# Altium schematic sheet MPCBoard.SchDoc
size 558 x 508 mm; SheetNumber: 1; SheetTotal: 1
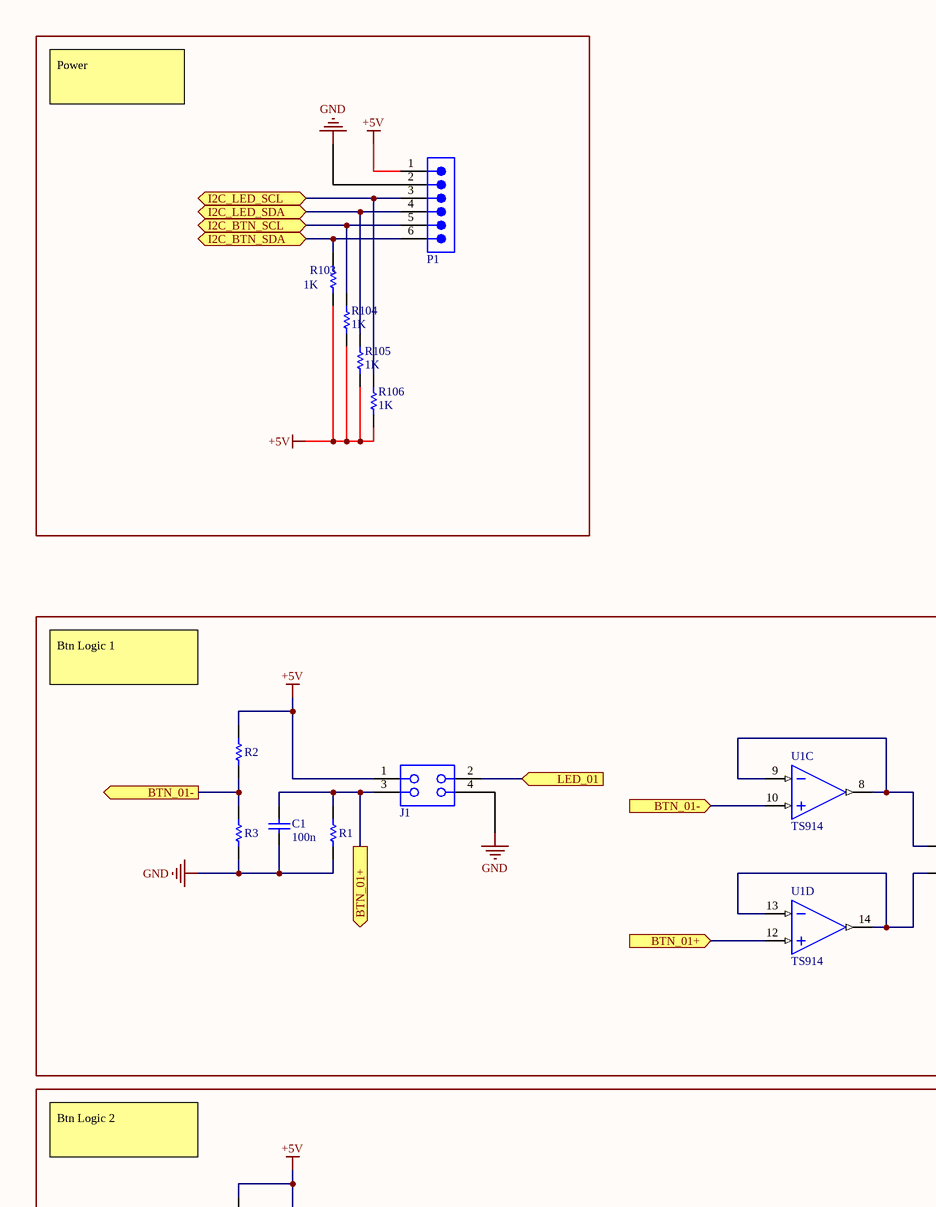
[diagram p0: MPCBoard.SchDoc, top left]
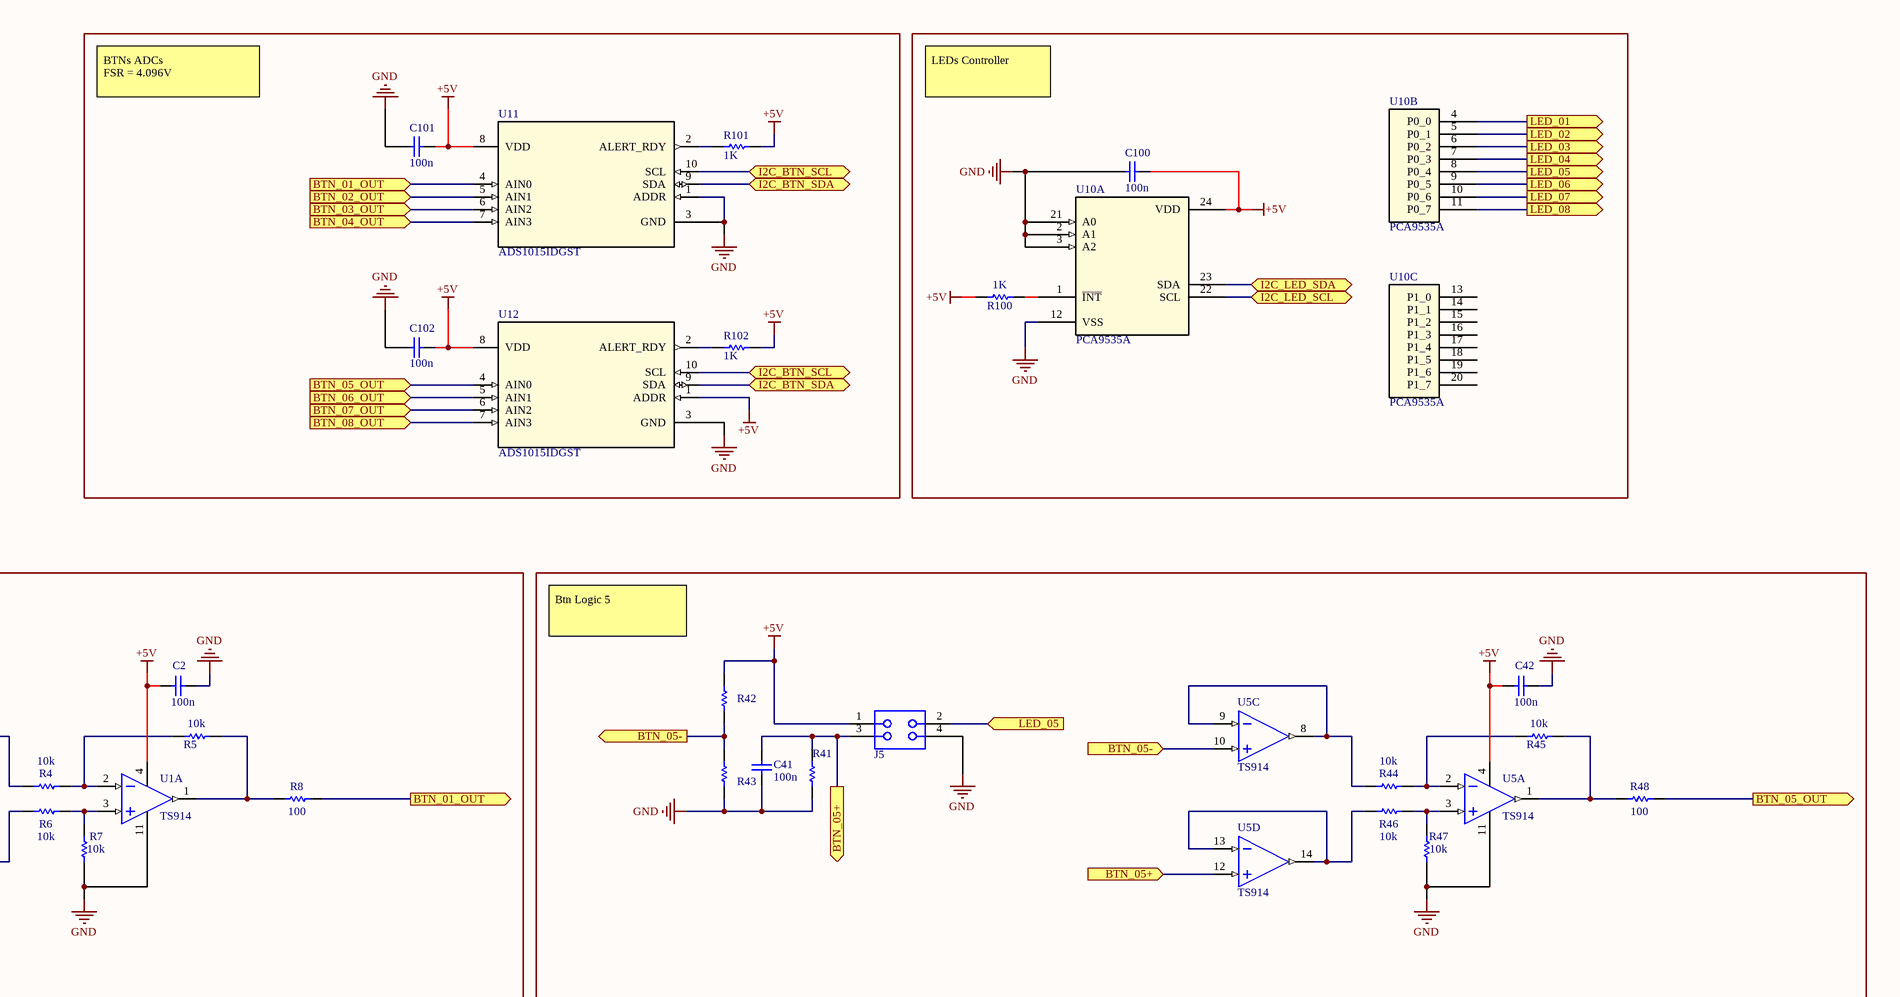
[diagram p1: MPCBoard.SchDoc, top right]
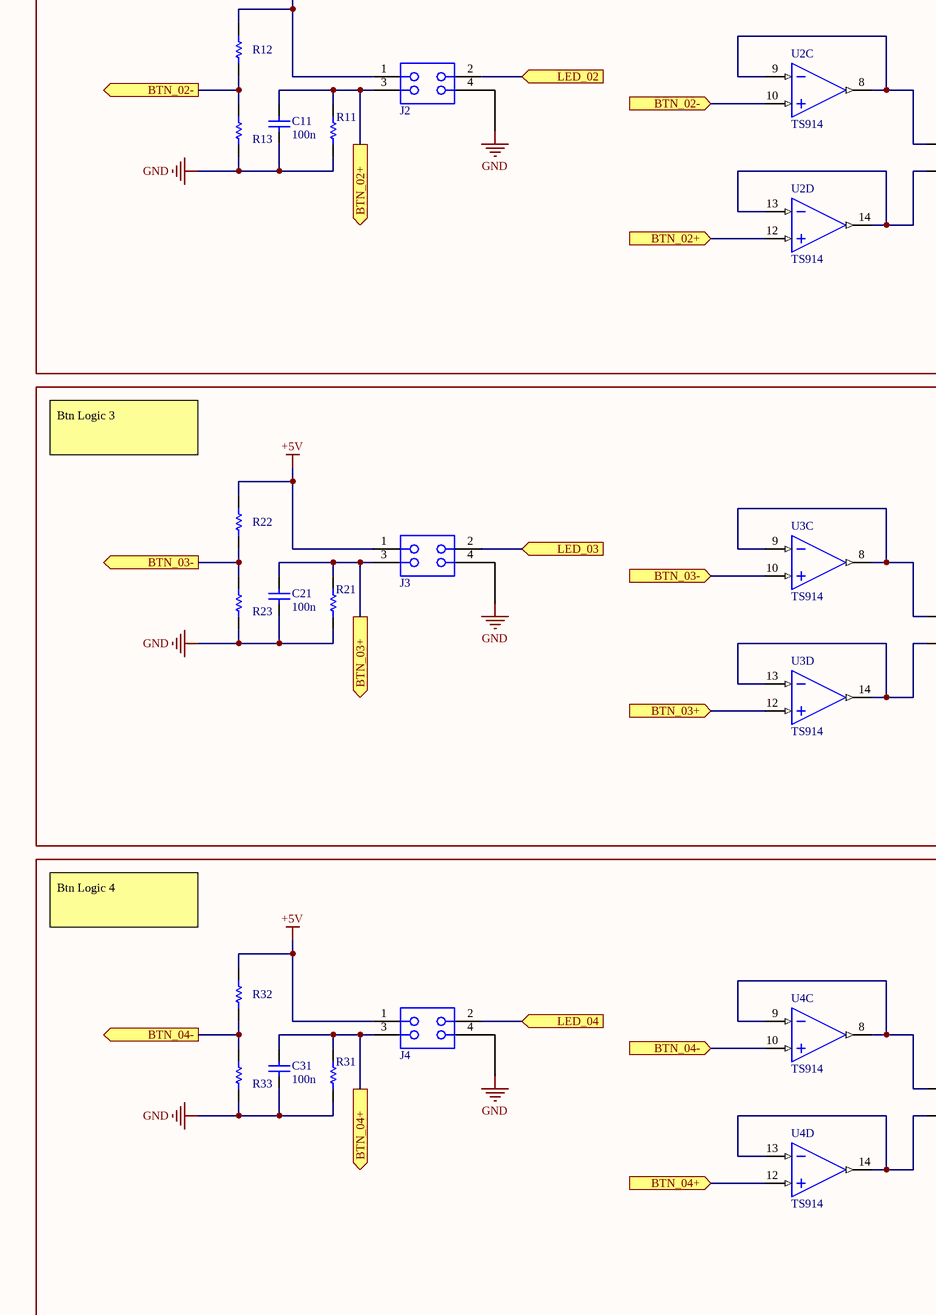
[diagram p2: MPCBoard.SchDoc, bottom left]
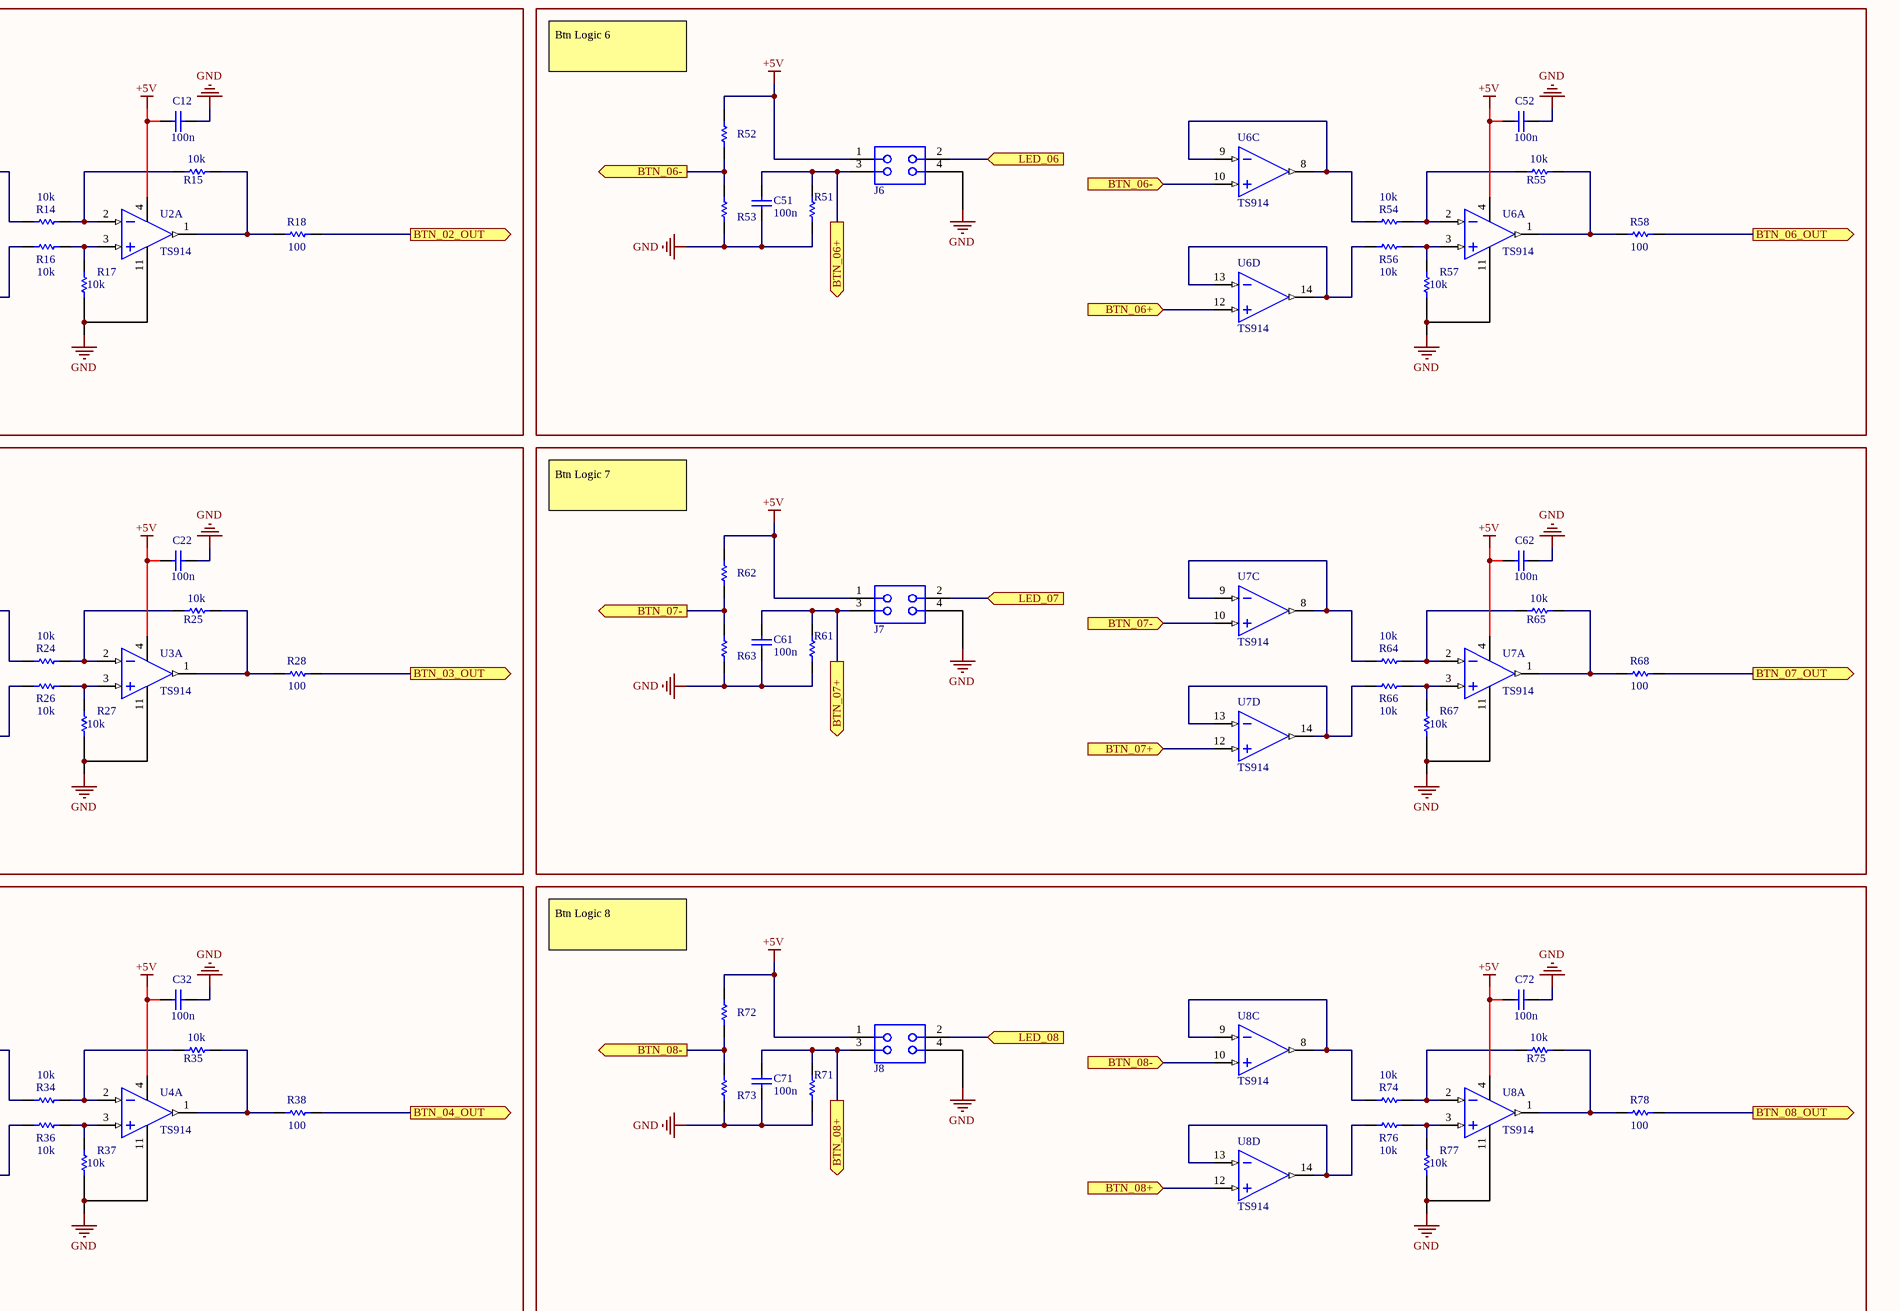
[diagram p3: MPCBoard.SchDoc, bottom right]

## Parts
C1  100n  [CAPC0603(1608)100_N]
C2  100n  [CAPC0603(1608)100_N]
C11  100n  [CAPC0603(1608)100_N]
C12  100n  [CAPC0603(1608)100_N]
C21  100n  [CAPC0603(1608)100_N]
C22  100n  [CAPC0603(1608)100_N]
C31  100n  [CAPC0603(1608)100_N]
C32  100n  [CAPC0603(1608)100_N]
C41  100n  [CAPC0603(1608)100_N]
C42  100n  [CAPC0603(1608)100_N]
C51  100n  [CAPC0603(1608)100_N]
C52  100n  [CAPC0603(1608)100_N]
C61  100n  [CAPC0603(1608)100_N]
C62  100n  [CAPC0603(1608)100_N]
C71  100n  [CAPC0603(1608)100_N]
C72  100n  [CAPC0603(1608)100_N]
C100  100n  [CAPC0603(1608)100_N]
C101  100n  [CAPC0603(1608)100_N]
C102  100n  [CAPC0603(1608)100_N]
J1  62000421821  [62000421821]  (value not drawn)
J2  62000421821  [62000421821]  (value not drawn)
J3  62000421821  [62000421821]  (value not drawn)
J4  62000421821  [62000421821]  (value not drawn)
J5  62000421821  [62000421821]  (value not drawn)
J6  62000421821  [62000421821]  (value not drawn)
J7  62000421821  [62000421821]  (value not drawn)
J8  62000421821  [62000421821]  (value not drawn)
P1  61300611121  [61300611121]  (value not drawn)
R1  RES  [RESC0603(1608)_N]  (value not drawn)
R2  RES  [RESC0603(1608)_N]  (value not drawn)
R3  RES  [RESC0603(1608)_N]  (value not drawn)
R4  10k  [RESC0603(1608)_N]
R5  10k  [RESC0603(1608)_N]
R6  10k  [RESC0603(1608)_N]
R7  10k  [RESC0603(1608)_N]
R8  100  [RESC0603(1608)_N]
R11  RES  [RESC0603(1608)_N]  (value not drawn)
R12  RES  [RESC0603(1608)_N]  (value not drawn)
R13  RES  [RESC0603(1608)_N]  (value not drawn)
R14  10k  [RESC0603(1608)_N]
R15  10k  [RESC0603(1608)_N]
R16  10k  [RESC0603(1608)_N]
R17  10k  [RESC0603(1608)_N]
R18  100  [RESC0603(1608)_N]
R21  RES  [RESC0603(1608)_N]  (value not drawn)
R22  RES  [RESC0603(1608)_N]  (value not drawn)
R23  RES  [RESC0603(1608)_N]  (value not drawn)
R24  10k  [RESC0603(1608)_N]
R25  10k  [RESC0603(1608)_N]
R26  10k  [RESC0603(1608)_N]
R27  10k  [RESC0603(1608)_N]
R28  100  [RESC0603(1608)_N]
R31  RES  [RESC0603(1608)_N]  (value not drawn)
R32  RES  [RESC0603(1608)_N]  (value not drawn)
R33  RES  [RESC0603(1608)_N]  (value not drawn)
R34  10k  [RESC0603(1608)_N]
R35  10k  [RESC0603(1608)_N]
R36  10k  [RESC0603(1608)_N]
R37  10k  [RESC0603(1608)_N]
R38  100  [RESC0603(1608)_N]
R41  RES  [RESC0603(1608)_N]  (value not drawn)
R42  RES  [RESC0603(1608)_N]  (value not drawn)
R43  RES  [RESC0603(1608)_N]  (value not drawn)
R44  10k  [RESC0603(1608)_N]
R45  10k  [RESC0603(1608)_N]
R46  10k  [RESC0603(1608)_N]
R47  10k  [RESC0603(1608)_N]
R48  100  [RESC0603(1608)_N]
R51  RES  [RESC0603(1608)_N]  (value not drawn)
R52  RES  [RESC0603(1608)_N]  (value not drawn)
R53  RES  [RESC0603(1608)_N]  (value not drawn)
R54  10k  [RESC0603(1608)_N]
R55  10k  [RESC0603(1608)_N]
R56  10k  [RESC0603(1608)_N]
R57  10k  [RESC0603(1608)_N]
R58  100  [RESC0603(1608)_N]
R61  RES  [RESC0603(1608)_N]  (value not drawn)
R62  RES  [RESC0603(1608)_N]  (value not drawn)
R63  RES  [RESC0603(1608)_N]  (value not drawn)
R64  10k  [RESC0603(1608)_N]
R65  10k  [RESC0603(1608)_N]
R66  10k  [RESC0603(1608)_N]
R67  10k  [RESC0603(1608)_N]
R68  100  [RESC0603(1608)_N]
R71  RES  [RESC0603(1608)_N]  (value not drawn)
R72  RES  [RESC0603(1608)_N]  (value not drawn)
R73  RES  [RESC0603(1608)_N]  (value not drawn)
R74  10k  [RESC0603(1608)_N]
R75  10k  [RESC0603(1608)_N]
R76  10k  [RESC0603(1608)_N]
R77  10k  [RESC0603(1608)_N]
R78  100  [RESC0603(1608)_N]
R100  1K  [RESC0603(1608)_N]
R101  1K  [RESC0603(1608)_N]
R102  1K  [RESC0603(1608)_N]
R103  1K  [RESC0603(1608)_N]
R104  1K  [RESC0603(1608)_N]
R105  1K  [RESC0603(1608)_N]
R106  1K  [RESC0603(1608)_N]
U1  TS914  [SO-14_STM]  (parts A,C,D of 4)
U2  TS914  [SO-14_STM]  (parts A,C,D of 4)
U3  TS914  [SO-14_STM]  (parts A,C,D of 4)
U4  TS914  [SO-14_STM]  (parts A,C,D of 4)
U5  TS914  [SO-14_STM]  (parts A,C,D of 4)
U6  TS914  [SO-14_STM]  (parts A,C,D of 4)
U7  TS914  [SO-14_STM]  (parts A,C,D of 4)
U8  TS914  [SO-14_STM]  (parts A,C,D of 4)
U10  PCA9535A  [TSSOP24-8N]  (parts A,B,C of 3)
U11  ADS1015IDGST  [DGS0010A_N]
U12  ADS1015IDGST  [DGS0010A_N]

## Ports
BTN_01+ (in, see MPCBoard[1B]), BTN_01+ (out, see MPCBoard[2B]), BTN_01- (in, see MPCBoard[1B]), BTN_01- (out, see MPCBoard[2B]), BTN_01_OUT (in, see MPCBoard[3B]), BTN_01_OUT (out, see MPCBoard[3A]), BTN_02+ (in, see MPCBoard[1C]), BTN_02+ (out, see MPCBoard[2C]), BTN_02- (in, see MPCBoard[1B]), BTN_02- (out, see MPCBoard[2B]), BTN_02_OUT (in, see MPCBoard[3B]), BTN_02_OUT (out, see MPCBoard[3A]), BTN_03+ (in, see MPCBoard[1C]), BTN_03+ (out, see MPCBoard[2C]), BTN_03- (in, see MPCBoard[1C]), BTN_03- (out, see MPCBoard[2C]), BTN_03_OUT (in, see MPCBoard[3C]), BTN_03_OUT (out, see MPCBoard[3A]), BTN_04+ (in, see MPCBoard[1D]), BTN_04+ (out, see MPCBoard[2D]), BTN_04- (in, see MPCBoard[1D]), BTN_04- (out, see MPCBoard[2D]), BTN_04_OUT (in, see MPCBoard[3D]), BTN_04_OUT (out, see MPCBoard[3A]), BTN_05+ (in, see MPCBoard[4B]), BTN_05+ (out, see MPCBoard[5B]), BTN_05- (in, see MPCBoard[4B]), BTN_05- (out, see MPCBoard[5B]), BTN_05_OUT (in, see MPCBoard[6B]), BTN_05_OUT (out, see MPCBoard[3A]), BTN_06+ (in, see MPCBoard[4C]), BTN_06+ (out, see MPCBoard[5C]), BTN_06- (in, see MPCBoard[4B]), BTN_06- (out, see MPCBoard[5B]), BTN_06_OUT (in, see MPCBoard[6B]), BTN_06_OUT (out, see MPCBoard[3A]), BTN_07+ (in, see MPCBoard[4C]), BTN_07+ (out, see MPCBoard[5C]), BTN_07- (in, see MPCBoard[4C]), BTN_07- (out, see MPCBoard[5C]), BTN_07_OUT (in, see MPCBoard[6C]), BTN_07_OUT (out, see MPCBoard[3A]), BTN_08+ (in, see MPCBoard[4D]), BTN_08+ (out, see MPCBoard[5D]), BTN_08- (in, see MPCBoard[4D]), BTN_08- (out, see MPCBoard[5D]), BTN_08_OUT (in, see MPCBoard[6D]), BTN_08_OUT (out, see MPCBoard[3A]), I2C_BTN_SCL (bidir, see MPCBoard[1A], MPCBoard[4A]), I2C_BTN_SCL (bidir, see MPCBoard[4A]), I2C_BTN_SDA (bidir, see MPCBoard[1A], MPCBoard[4A]), I2C_BTN_SDA (bidir, see MPCBoard[4A]), I2C_LED_SCL (bidir, see MPCBoard[1A]), I2C_LED_SCL (bidir, see MPCBoard[5A]), I2C_LED_SDA (bidir, see MPCBoard[1A]), I2C_LED_SDA (bidir, see MPCBoard[5A]), LED_01 (in, see MPCBoard[6A]), LED_01 (out, see MPCBoard[2B]), LED_02 (in, see MPCBoard[6A]), LED_02 (out, see MPCBoard[2B]), LED_03 (in, see MPCBoard[6A]), LED_03 (out, see MPCBoard[2C]), LED_04 (in, see MPCBoard[6A]), LED_04 (out, see MPCBoard[2D]), LED_05 (in, see MPCBoard[6A]), LED_05 (out, see MPCBoard[4B]), LED_06 (in, see MPCBoard[6A]), LED_06 (out, see MPCBoard[4B]), LED_07 (in, see MPCBoard[6A]), LED_07 (out, see MPCBoard[4C]), LED_08 (in, see MPCBoard[6A]), LED_08 (out, see MPCBoard[4D])

## Nets
+5V: C2.1 C12.1 C22.1 C32.1 C42.1 C52.1 C62.1 C72.1 C100.2 C101.2 C102.2 J1.1 J2.1 J3.1 J4.1 J5.1 J6.1 J7.1 J8.1 P1.1 R2.1 R12.1 R22.1 R32.1 R42.1 R52.1 R62.1 R72.1 R100.1 R101.1 R102.1 R103.2 R104.2 R105.2 R106.2 U1.4(Vcc+) U2.4(Vcc+) U3.4(Vcc+) U4.4(Vcc+) U5.4(Vcc+) U6.4(Vcc+) U7.4(Vcc+) U8.4(Vcc+) U10.24(VDD) U11.8(VDD) U12.1(ADDR) U12.8(VDD)
GND: C1.1 C2.2 C11.1 C12.2 C21.1 C22.2 C31.1 C32.2 C41.1 C42.2 C51.1 C52.2 C61.1 C62.2 C71.1 C72.2 C100.1 C101.1 C102.1 J1.4 J2.4 J3.4 J4.4 J5.4 J6.4 J7.4 J8.4 P1.2 R1.2 R3.2 R7.1 R11.2 R13.2 R17.1 R21.2 R23.2 R27.1 R31.2 R33.2 R37.1 R41.2 R43.2 R47.1 R51.2 R53.2 R57.1 R61.2 R63.2 R67.1 R71.2 R73.2 R77.1 U1.11(Vcc-) U2.11(Vcc-) U3.11(Vcc-) U4.11(Vcc-) U5.11(Vcc-) U6.11(Vcc-) U7.11(Vcc-) U8.11(Vcc-) U10.2(A1) U10.3(A2) U10.12(VSS) U10.21(A0) U11.1(ADDR) U11.3(GND) U12.3(GND)
BTN_01+: C1.2 J1.3 R1.1 U1.12(Non-Inverting) ; port BTN_01+
BTN_01-: R2.2 R3.1 U1.10(Non-Inverting) ; port BTN_01-
BTN_01_OUT: R8.1 U11.4(AIN0) ; port BTN_01_OUT
BTN_02+: C11.2 J2.3 R11.1 U2.12(Non-Inverting) ; port BTN_02+
BTN_02-: R12.2 R13.1 U2.10(Non-Inverting) ; port BTN_02-
BTN_02_OUT: R18.1 U11.5(AIN1) ; port BTN_02_OUT
BTN_03+: C21.2 J3.3 R21.1 U3.12(Non-Inverting) ; port BTN_03+
BTN_03-: R22.2 R23.1 U3.10(Non-Inverting) ; port BTN_03-
BTN_03_OUT: R28.1 U11.6(AIN2) ; port BTN_03_OUT
BTN_04+: C31.2 J4.3 R31.1 U4.12(Non-Inverting) ; port BTN_04+
BTN_04-: R32.2 R33.1 U4.10(Non-Inverting) ; port BTN_04-
BTN_04_OUT: R38.1 U11.7(AIN3) ; port BTN_04_OUT
BTN_05+: C41.2 J5.3 R41.1 U5.12(Non-Inverting) ; port BTN_05+
BTN_05-: R42.2 R43.1 U5.10(Non-Inverting) ; port BTN_05-
BTN_05_OUT: R48.1 U12.4(AIN0) ; port BTN_05_OUT
BTN_06+: C51.2 J6.3 R51.1 U6.12(Non-Inverting) ; port BTN_06+
BTN_06-: R52.2 R53.1 U6.10(Non-Inverting) ; port BTN_06-
BTN_06_OUT: R58.1 U12.5(AIN1) ; port BTN_06_OUT
BTN_07+: C61.2 J7.3 R61.1 U7.12(Non-Inverting) ; port BTN_07+
BTN_07-: R62.2 R63.1 U7.10(Non-Inverting) ; port BTN_07-
BTN_07_OUT: R68.1 U12.6(AIN2) ; port BTN_07_OUT
BTN_08+: C71.2 J8.3 R71.1 U8.12(Non-Inverting) ; port BTN_08+
BTN_08-: R72.2 R73.1 U8.10(Non-Inverting) ; port BTN_08-
BTN_08_OUT: R78.1 U12.7(AIN3) ; port BTN_08_OUT
I2C_BTN_SCL: P1.5 R104.1 U11.10(SCL) U12.10(SCL) ; port I2C_BTN_SCL
I2C_BTN_SDA: P1.6 R103.1 U11.9(SDA) U12.9(SDA) ; port I2C_BTN_SDA
I2C_LED_SCL: P1.3 R106.1 U10.22(SCL) ; port I2C_LED_SCL
I2C_LED_SDA: P1.4 R105.1 U10.23(SDA) ; port I2C_LED_SDA
LED_01: J1.2 U10.4(P0_0) ; port LED_01
LED_02: J2.2 U10.5(P0_1) ; port LED_02
LED_03: J3.2 U10.6(P0_2) ; port LED_03
LED_04: J4.2 U10.7(P0_3) ; port LED_04
LED_05: J5.2 U10.8(P0_4) ; port LED_05
LED_06: J6.2 U10.9(P0_5) ; port LED_06
LED_07: J7.2 U10.10(P0_6) ; port LED_07
LED_08: J8.2 U10.11(P0_7) ; port LED_08
NetR4_1: R4.1 U1.8(Output) U1.9(Inverting)
NetR4_2: R4.2 R5.2 U1.2(Inverting)
NetR5_1: R5.1 R8.2 U1.1(Output)
NetR6_1: R6.1 U1.13(Inverting) U1.14(Output)
NetR6_2: R6.2 R7.2 U1.3(Non-Inverting)
NetR14_1: R14.1 U2.8(Output) U2.9(Inverting)
NetR14_2: R14.2 R15.2 U2.2(Inverting)
NetR15_1: R15.1 R18.2 U2.1(Output)
NetR16_1: R16.1 U2.13(Inverting) U2.14(Output)
NetR16_2: R16.2 R17.2 U2.3(Non-Inverting)
NetR24_1: R24.1 U3.8(Output) U3.9(Inverting)
NetR24_2: R24.2 R25.2 U3.2(Inverting)
NetR25_1: R25.1 R28.2 U3.1(Output)
NetR26_1: R26.1 U3.13(Inverting) U3.14(Output)
NetR26_2: R26.2 R27.2 U3.3(Non-Inverting)
NetR34_1: R34.1 U4.8(Output) U4.9(Inverting)
NetR34_2: R34.2 R35.2 U4.2(Inverting)
NetR35_1: R35.1 R38.2 U4.1(Output)
NetR36_1: R36.1 U4.13(Inverting) U4.14(Output)
NetR36_2: R36.2 R37.2 U4.3(Non-Inverting)
NetR44_1: R44.1 U5.8(Output) U5.9(Inverting)
NetR44_2: R44.2 R45.2 U5.2(Inverting)
NetR45_1: R45.1 R48.2 U5.1(Output)
NetR46_1: R46.1 U5.13(Inverting) U5.14(Output)
NetR46_2: R46.2 R47.2 U5.3(Non-Inverting)
NetR54_1: R54.1 U6.8(Output) U6.9(Inverting)
NetR54_2: R54.2 R55.2 U6.2(Inverting)
NetR55_1: R55.1 R58.2 U6.1(Output)
NetR56_1: R56.1 U6.13(Inverting) U6.14(Output)
NetR56_2: R56.2 R57.2 U6.3(Non-Inverting)
NetR64_1: R64.1 U7.8(Output) U7.9(Inverting)
NetR64_2: R64.2 R65.2 U7.2(Inverting)
NetR65_1: R65.1 R68.2 U7.1(Output)
NetR66_1: R66.1 U7.13(Inverting) U7.14(Output)
NetR66_2: R66.2 R67.2 U7.3(Non-Inverting)
NetR74_1: R74.1 U8.8(Output) U8.9(Inverting)
NetR74_2: R74.2 R75.2 U8.2(Inverting)
NetR75_1: R75.1 R78.2 U8.1(Output)
NetR76_1: R76.1 U8.13(Inverting) U8.14(Output)
NetR76_2: R76.2 R77.2 U8.3(Non-Inverting)
NetR100_2: R100.2 U10.1(~{INT})
NetR101_2: R101.2 U11.2(ALERT_RDY)
NetR102_2: R102.2 U12.2(ALERT_RDY)

Not connected (* = marked no-connect by the designer): U10 13(P1_0) 14(P1_1) 15(P1_2) 16(P1_3) 17(P1_4) 18(P1_5) 19(P1_6) 20(P1_7)

## Notes on the sheet
- Power
- BTNs ADCs
  FSR = 4.096V
- LEDs Controller
- Btn Logic 1
- Btn Logic 5
- Btn Logic 2
- Btn Logic 6
- Btn Logic 3
- Btn Logic 7
- Btn Logic 4
- Btn Logic 8

## Library data of the parts
C1 C2 C11 C12 C21 C22 C31 C32 C41 C42 C51 C52 C61 C62 C71 C72 C100-C102 = CAP
J1-J8 = 62000421821: WR-PHD Socket Header, THT, Vertical, pitch 2mm, 2 Row, 4P; Manufacturer: Wurth Elektronik; Contact Resistance: 20mOhm; Rated Current: 2A; Working Voltage: 250V; Withstanding Voltage: 500V; System: Connector; Manufacturer Part Number: 62000421821; Category: Board-to-Board Connectors; Match Code: WR-PHD; ComponentLink1Description: Website Link; ComponentLink1URL: https://www.we-online.com/redexpert/article/62000421821?ad; ComponentLink2Description: Datasheet Link; ComponentLink2URL: https://www.we-online.com/redexpert/spec/62000421821?ad; Mount: Through Hole; Operating Temperature Max: 105°C; Operating Temperature Min: -40°C; Packaging: Tube; Gender: Socket Header; Number of Pins: 4; Number of Rows: 2; Orientation: Vertical; Pitch: 2mm
P1 = 61300611121: WR-PHD Pin Header, THT, Vertical, pitch 2.54mm, 1 Row, 6P; Manufacturer: Wurth Elektronik; Contact Resistance: 20mOhm; Rated Current: 3A; Working Voltage: 250V; Withstanding Voltage: 500V; System: Connector; Manufacturer Part Number: 61300611121; Category: Board-to-Board Connectors; Match Code: WR-PHD; ComponentLink1Description: Website Link; ComponentLink1URL: https://www.we-online.com/redexpert/article/61300611121?ad; ComponentLink2Description: Datasheet Link; ComponentLink2URL: https://www.we-online.com/redexpert/spec/61300611121?ad; Mount: Through Hole; Operating Temperature Max: 105°C; Operating Temperature Min: -40°C; Packaging: Bag; Gender: Pin Header; Number of Pins: 6; Number of Rows: 1; Orientation: Vertical; Pitch: 2.54mm
R4-R8 R14-R18 R24-R28 R34-R38 R44-R48 R54-R58 R64-R68 R74-R78 R100-R106 = RES
U10 = PCA9535A: Low-voltage 16-bit I2C-bus I/O port with interrupt
U11 U12 = ADS1015IDGST: 12-bit, 3.3-kSPS, 4-channel, delta-sigma ADC with PGA, oscillator, VREF, comparator and I2C 10-VSSOP -40 to 125; Manufacturer_Name: Texas Instruments; PartNumber: ADS1015IDGSR; CompType: IC; TYPE: TYPE; RefDes: RefDes; Copyright: Copyright (C) 2025 Ultra Librarian. All rights reserved.; Manufacturer_Part_Number: ADS1015IDGST; Datasheet: https://www.ti.com/lit/gpn/ads1015; Alternate_PartNumber: ADS1015IDGST; PackageReference: DGS0010A; MountType: SMT; RoHS: Y; Manufacturer: Texas Instruments